# EAGLE design motors_motherBoard_simple_v2 (EAGLE 6.5.0)
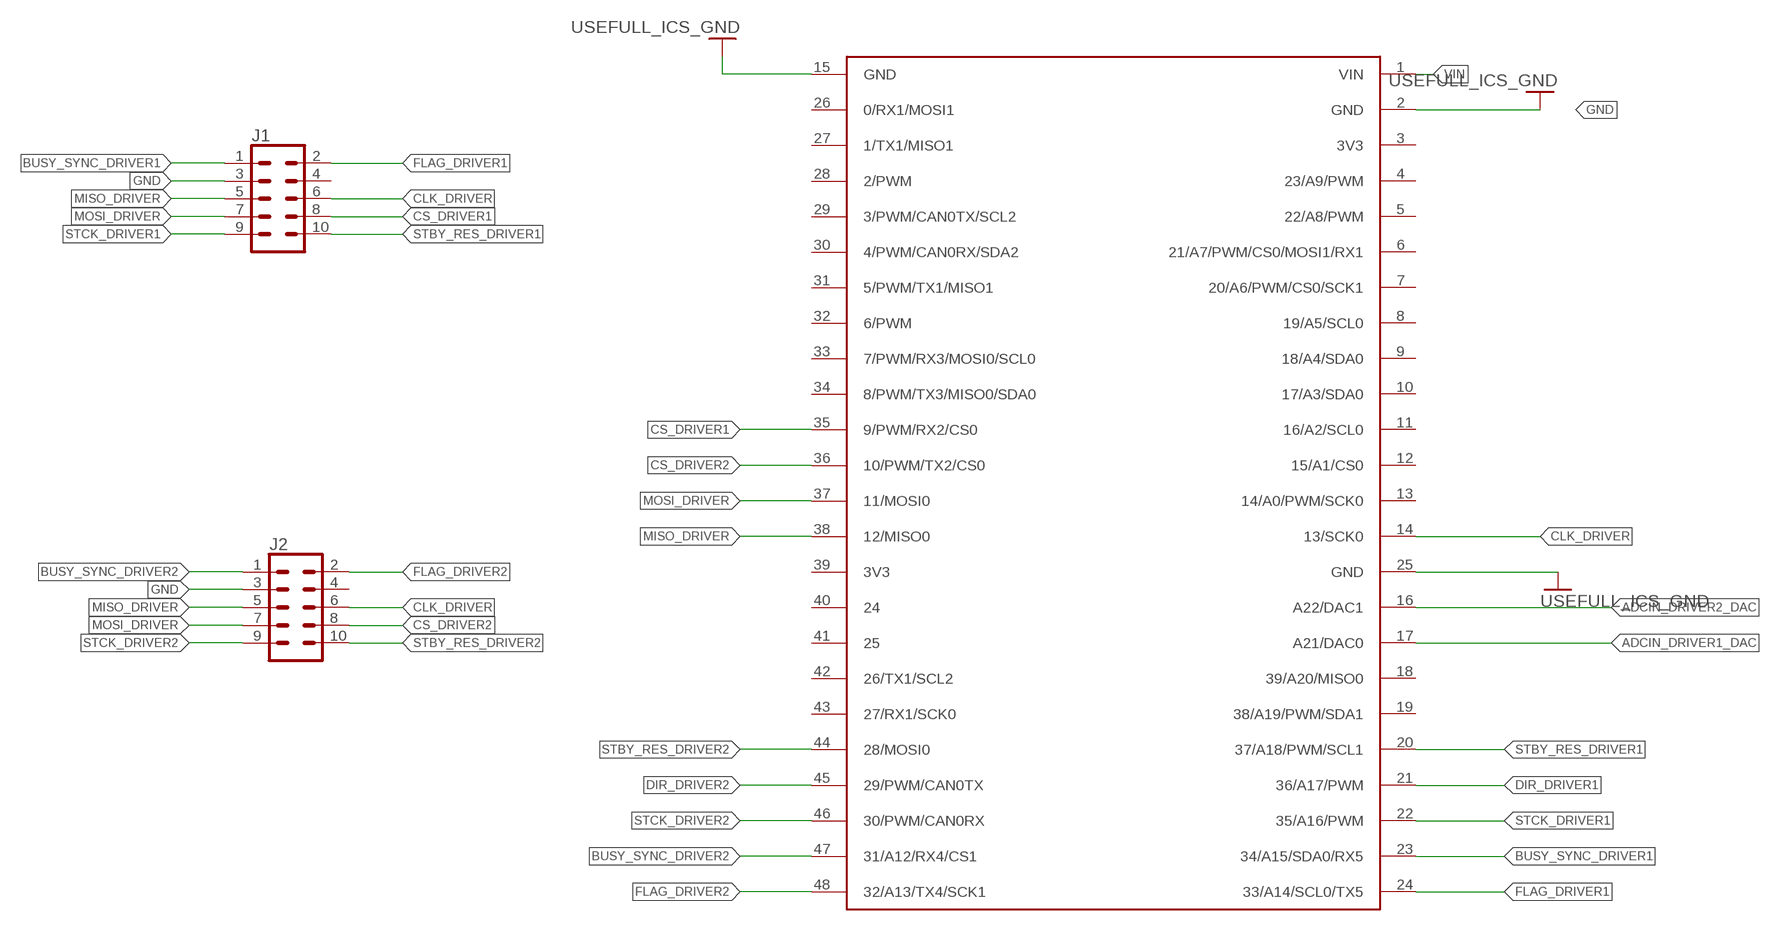
[diagram p0: schematic, sheet 1]

## Parts
J1  SPARKFUN-CONNECTORS_CONN_05X2SHD_LOCK  [SPARKFUN-CONNECTORS_2X5-SHROUDED_LOCK]
J2  SPARKFUN-CONNECTORS_CONN_05X2SHD_LOCK  [SPARKFUN-CONNECTORS_2X5-SHROUDED_LOCK]
U$3  USEFULL_ICS_TEENSY_BASE_ADAPTER  [USEFULL_ICS_TEENSY_BASE_ADAPTER]

## Nets
ADCIN_DRIVER1_DAC: U$3.17(A21/DAC0)
ADCIN_DRIVER2_DAC: U$3.16(A22/DAC1)
BUSY_SYNC_DRIVER1: J1.1 U$3.23(34/A15/SDA0/RX5)
BUSY_SYNC_DRIVER2: J2.1 U$3.47(31/A12/RX4/CS1)
CLK_DRIVER: J1.6 J2.6 U$3.14(13/SCK0)
CS_DRIVER1: J1.8 U$3.35(9/PWM/RX2/CS0)
CS_DRIVER2: J2.8 U$3.36(10/PWM/TX2/CS0)
DIR_DRIVER1: U$3.21(36/A17/PWM)
DIR_DRIVER2: U$3.45(29/PWM/CAN0TX)
FLAG_DRIVER1: J1.2 U$3.24(33/A14/SCL0/TX5)
FLAG_DRIVER2: J2.2 U$3.48(32/A13/TX4/SCK1)
GND: J1.3 J2.3 U$3.2(GND) U$3.15(GND) U$3.25(GND) ; supply symbol labelled USEFULL_ICS_GND
MISO_DRIVER: J1.5 J2.5 U$3.38(12/MISO0)
MOSI_DRIVER: J1.7 J2.7 U$3.37(11/MOSI0)
STBY_RES_DRIVER1: J1.10 U$3.20(37/A18/PWM/SCL1)
STBY_RES_DRIVER2: J2.10 U$3.44(28/MOSI0)
STCK_DRIVER1: J1.9 U$3.22(35/A16/PWM)
STCK_DRIVER2: J2.9 U$3.46(30/PWM/CAN0RX)
VIN: U$3.1(VIN)
Unconnected: J1.4 J2.4 U$3.3(3V3) U$3.4(23/A9/PWM) U$3.5(22/A8/PWM) U$3.6(21/A7/PWM/CS0/MOSI1/RX1) U$3.7(20/A6/PWM/CS0/SCK1) U$3.8(19/A5/SCL0) U$3.9(18/A4/SDA0) U$3.10(17/A3/SDA0) U$3.11(16/A2/SCL0) U$3.12(15/A1/CS0) U$3.13(14/A0/PWM/SCK0) U$3.18(39/A20/MISO0) U$3.19(38/A19/PWM/SDA1) U$3.26(0/RX1/MOSI1) U$3.27(1/TX1/MISO1) U$3.28(2/PWM) U$3.29(3/PWM/CAN0TX/SCL2) U$3.30(4/PWM/CAN0RX/SDA2) U$3.31(5/PWM/TX1/MISO1) U$3.32(6/PWM) U$3.33(7/PWM/RX3/MOSI0/SCL0) U$3.34(8/PWM/TX3/MISO0/SDA0) U$3.39(3V3) U$3.40 U$3.41 U$3.42(26/TX1/SCL2) U$3.43(27/RX1/SCK0)

## Library data of the parts
J1 J2 = motors_motherBoard_simple_v2:SPARKFUN-CONNECTORS_CONN_05X2: Multi connection point. Often used as Generic Header-pin footprint for 0.1 inch spaced/style header connections For AVR SPI programming port, see special device with nice symbol: "AVR_SPI_PROG_5x2.dev" You can populate with any combo of single row headers, but if you'd like an exact match, check these: 2x5 AVR ICSP Male Header <https://www.sparkfun.com/products/778> (PRT-00778) 2x5 Pin Shrouded Header <https://www.sparkfun.com/products/8506> (PRT-08506) On any of the 0.1 inch spaced packages, you can populate with these: Break Away Headers - Straight <https://www.sparkfun.com/products/116> (PRT-00116) Break Away Male Headers - Right Angle <https://www.sparkfun.com/products/553> (PRT-00553) Female Headers <https://www.sparkfun.com/products/115> (PRT-00115) Break Away Headers - Machine Pin <https://www.sparkfun.com/products/117> (PRT-00117) Break Away Female Headers - Swiss Machine Pin <https://www.sparkfun.com/products/743> (PRT-00743) Special note: the shrouded connector mates well with our 5x2 ribbon cables: 2x5 Pin IDC Ribbon Cable <https://www.sparkfun.com/products/8535> (PRT-08535); PROD_ID: CONN-08671; SF_ID: PRT-08506
U$3 = motors_motherBoard_simple_v2:USEFULL_ICS_TEENSY_BASE_ADAPTER

## Board
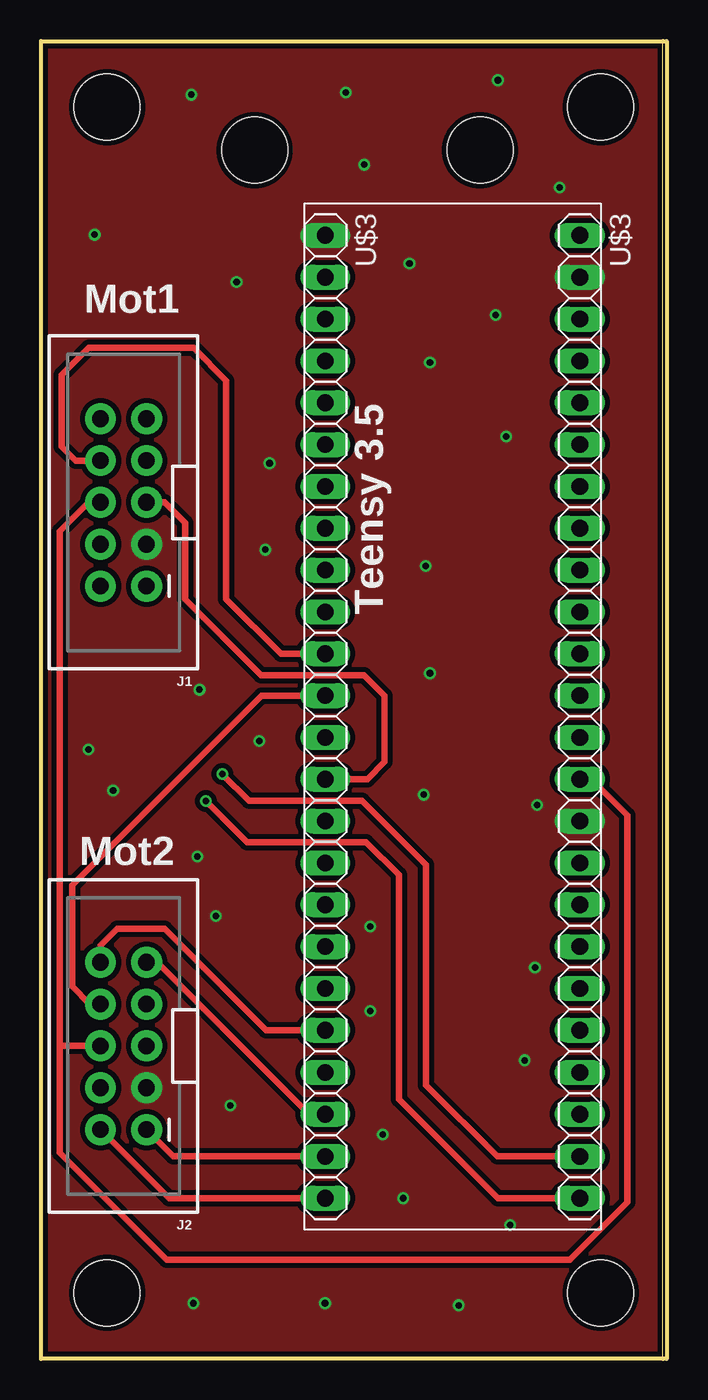
[diagram p1: board, top side]
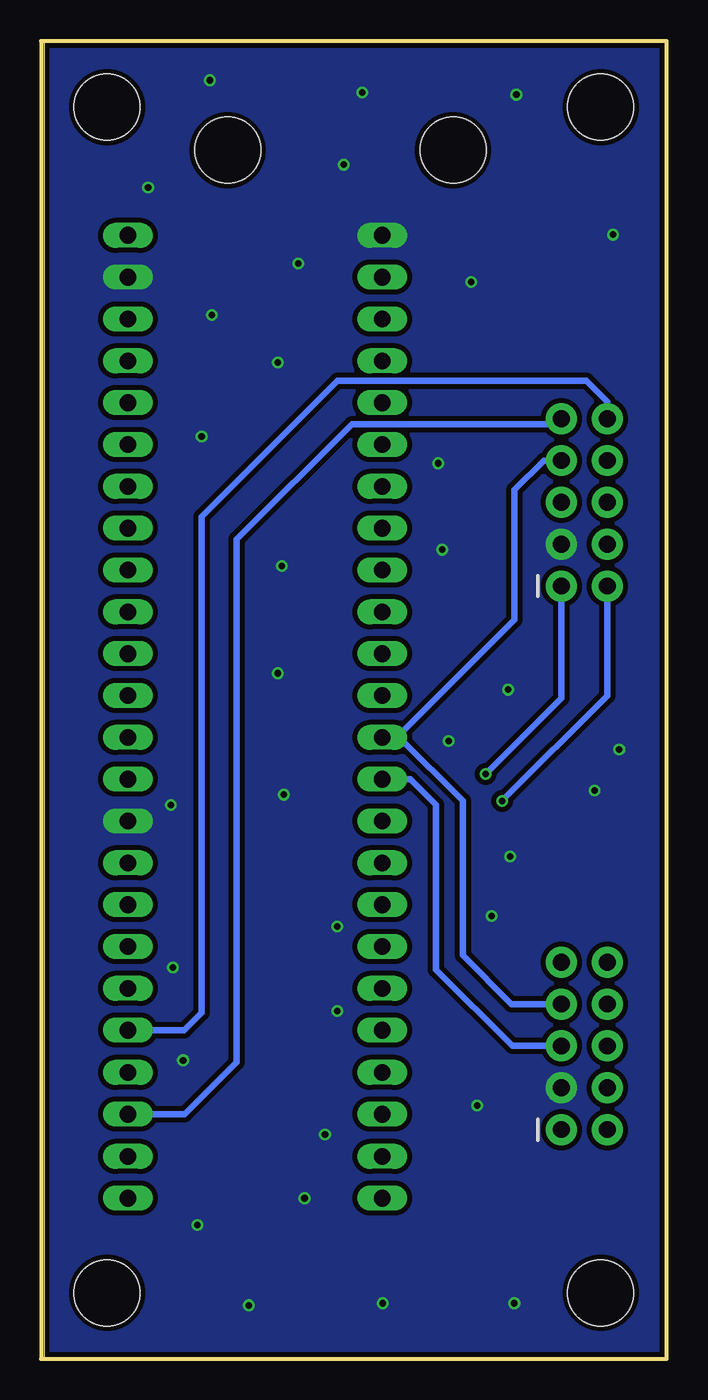
[diagram p2: board, bottom side, seen from below]

Size 38 x 80 mm. Coordinates in mm from the lower left corner, seen from the top.
Outline: 37.77,0 37.77,80
Outline: 37.77,80 0,80 0,0 37.77,0
Outline: 37.77,80 38,80 38,0 37.77,0
Copper layers (1*16): Top 0.035mm / dielectric 1.5mm / Bottom 0.035mm
Design rules "SeeedStudio_2layer_DRU_no_angle_20140221": minimum track width 6mil, minimum drill 12mil, track to track 6mil, track to pad 6mil, pad to pad 6mil, via to via 6mil, smd to smd 0mil, copper to edge 10mil, drill to drill 10mil, minimum pad ring 10mil, minimum via ring 6mil, stop-mask expansion 2mil, vias tented up to drill 100mil, thermal gap 10mil
Holes 4 mm at 12.97,73.39 26.67,73.39 4,76 34,76 4,4 34,4

### Footprints (pad centres in the part's own frame; a part is rotated, then mirrored left to right if it is on the bottom)
SPARKFUN-CONNECTORS_2X5-SHROUDED_LOCK = drill 1.016 pad 1.88: 1 -1.397,5.08; 2 1.397,5.08; 3 -1.397,2.54; 4 1.397,2.54; 5 -1.397,0; 6 1.397,0; 7 -1.397,-2.54; 8 1.397,-2.54; 9 -1.397,-5.08; 10 1.397,-5.08
USEFULL_ICS_TEENSY_BASE_ADAPTER = drill 1.016 long: 1 -29.21,7.73; 2 -26.67,7.73; 3 -24.13,7.73; 4 -21.59,7.73; 5 -19.05,7.73; 6 -16.51,7.73; 7 -13.97,7.73; 8 -11.43,7.73; 9 -8.89,7.73; 10 -6.35,7.73; 11 -3.81,7.73; 12 -1.27,7.73; 13 1.27,7.73; 14 3.81,7.73; 15 6.35,7.73; 16 8.89,7.73; 17 11.43,7.73; 18 13.97,7.73; 19 16.51,7.73; 20 19.05,7.73; 21 21.61,7.73; 22 24.15,7.73; 23 26.71,7.73; 24 29.25,7.73; 25 -29.21,-7.73; 26 -26.67,-7.73; 27 -24.13,-7.73; 28 -21.59,-7.73; 29 -19.05,-7.73; 30 -16.51,-7.73; 31 -13.97,-7.73; 32 -11.43,-7.73; 33 -8.89,-7.73; 34 -6.35,-7.73; 35 -3.81,-7.73; 36 -1.27,-7.73; 37 1.27,-7.73; 38 3.81,-7.73; 39 6.35,-7.73; 40 8.89,-7.73; 41 11.43,-7.73; 42 13.97,-7.73; 43 16.51,-7.73; 44 19.05,-7.73; 45 21.61,-7.73; 46 24.15,-7.73; 47 26.71,-7.73; 48 29.25,-7.73

### Placement (x,y rotation side)
J1  5,52 180 top
J2  5,19 180 top
U$3  25,39 270 top

### Tracks (layer width: path | path; a pad name or v marks a point on that pad's centre or on a via)
BUSY_SYNC_DRIVER1  (via drill 0.4)
  Top 0.4: U$3.23 27.71,12.29 23.38,16.62 23.38,30 19.5,33.88 12.62,33.88 v11,35.5
  Bottom 0.4: v11,35.5 6.4,40.1 J1.1
BUSY_SYNC_DRIVER2
  Top 0.4: U$3.47 8.03,12.29 J2.1
CLK_DRIVER
  Top 0.4: 1.12,19 1.12,50.25 2.88,52 J1.6 | U$3.14 33.44,35.19 35.62,33 35.62,9.5 32.12,6 7.62,6 1.12,12.5 1.12,18.62 1.12,19 | J2.6 1.12,19
CS_DRIVER1
  Top 0.4: U$3.35 14.56,42.81 11.25,46.12 11.25,59.38 9.25,61.38 2.88,61.38 1.25,59.75 1.25,55.38 2.08,54.54 J1.8
CS_DRIVER2
  Top 0.4: U$3.36 13.39,40.27 1.88,28.75 1.88,22.62 2.96,21.54 J2.8
FLAG_DRIVER1  (via drill 0.4)
  Top 0.4: U$3.24 27.75,9.75 21.75,15.75 21.75,29.38 19.75,31.38 12.5,31.38 v10,33.88
  Bottom 0.4: J1.2 3.6,40.27 v10,33.88
FLAG_DRIVER2
  Top 0.4: U$3.48 7.77,9.75 J2.2
GND  (via drill 0.4)
  other vias: 9.25,3.38 17.25,3.38 25.38,3.25 22,9.75 11.5,15.38 9.5,30.5 10.62,26.88 20,26.25 20,21.12 23.25,34.25 23.62,41.62 23.38,48.12 13.88,54.38 13.62,49.12 9.62,40.62 13.25,37.5 2.88,37 4.38,34.5 3.25,68.25 11.88,65.38 9.12,76.75 18.5,76.88 27.75,77.62 19.62,72.5 22.38,66.5 23.62,60.5 27.62,63.38 31.5,71.12 28.25,56 30.12,33.62 30,23.75 29.38,18.12 20.75,13.62 28.5,8.12
  pour Bottom (isolate 0.305, no thermals): 0,0 0,80 38,80 38,0
  pour Top (isolate 0.305, no thermals): 0,0 0,80 38,80 38,0
MISO_DRIVER
  Top 0.4: J1.5 7.5,52 8.75,50.75 8.75,46.12 13.38,41.5 19.62,41.5 20.88,40.25 20.88,36.25 19.82,35.19 U$3.38
  Bottom 0.4: J2.5 9.38,19 14,23.62 14,33.62 15.56,35.19 U$3.38
MOSI_DRIVER
  Bottom 0.4: J2.7 9.41,21.54 12.38,24.5 12.38,33.88 16.25,37.75 16.38,37.75 | J1.7 7.46,54.54 9.25,52.75 9.25,44.88 16.38,37.75 | 16.38,37.75 17.25,37.75 U$3.37
STBY_RES_DRIVER1
  Bottom 0.4: U$3.20 29.3,19.95 28.25,21 28.25,51.12 20,59.38 4.88,59.38 3.6,58.1 J1.10
STBY_RES_DRIVER2
  Top 0.4: U$3.44 13.68,19.95 7.5,26.12 4.62,26.12 3.6,25.1 J2.10
STCK_DRIVER1
  Bottom 0.4: U$3.22 29.27,14.85 26.12,18 26.12,49.75 19.12,56.75 6.73,56.75 J1.9
STCK_DRIVER2
  Top 0.4: U$3.46 16.27,14.85 7.04,24.08 J2.9

### Text on the board
tPlace: Mot1 | Teensy 3.5 | Mot2